# EAGLE design Teensy_CARD_V2 (EAGLE 9.7.0)
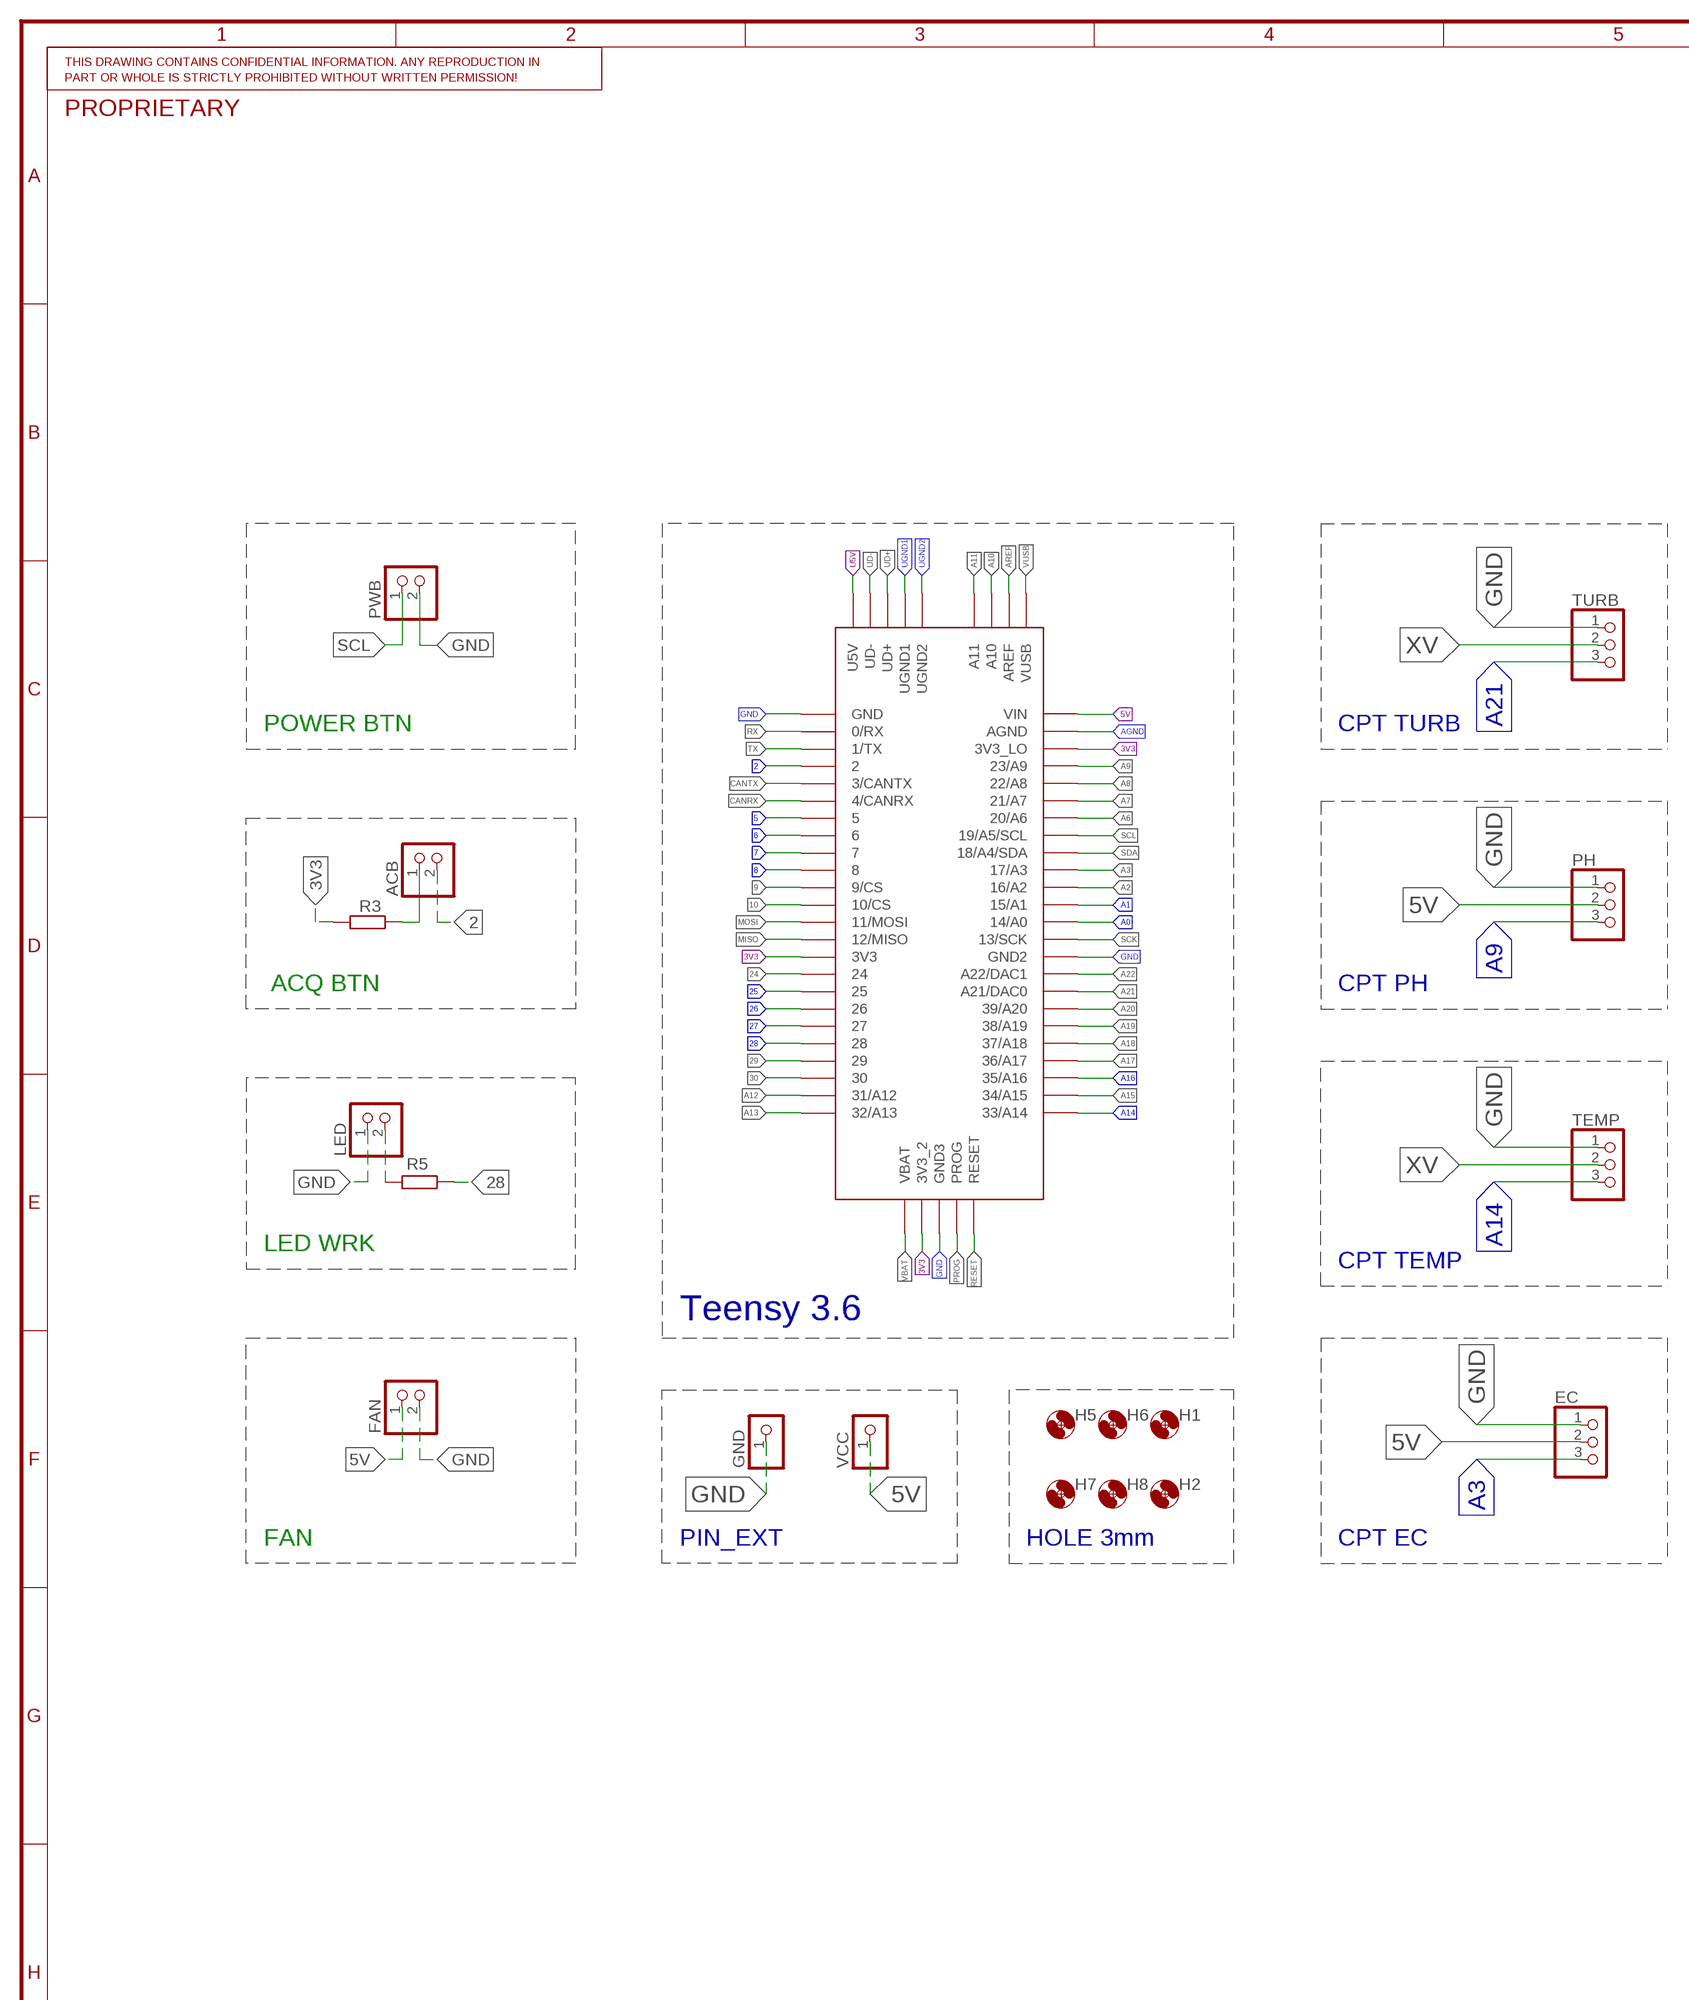
[diagram p0: schematic, sheet 1, part 1 of 2]
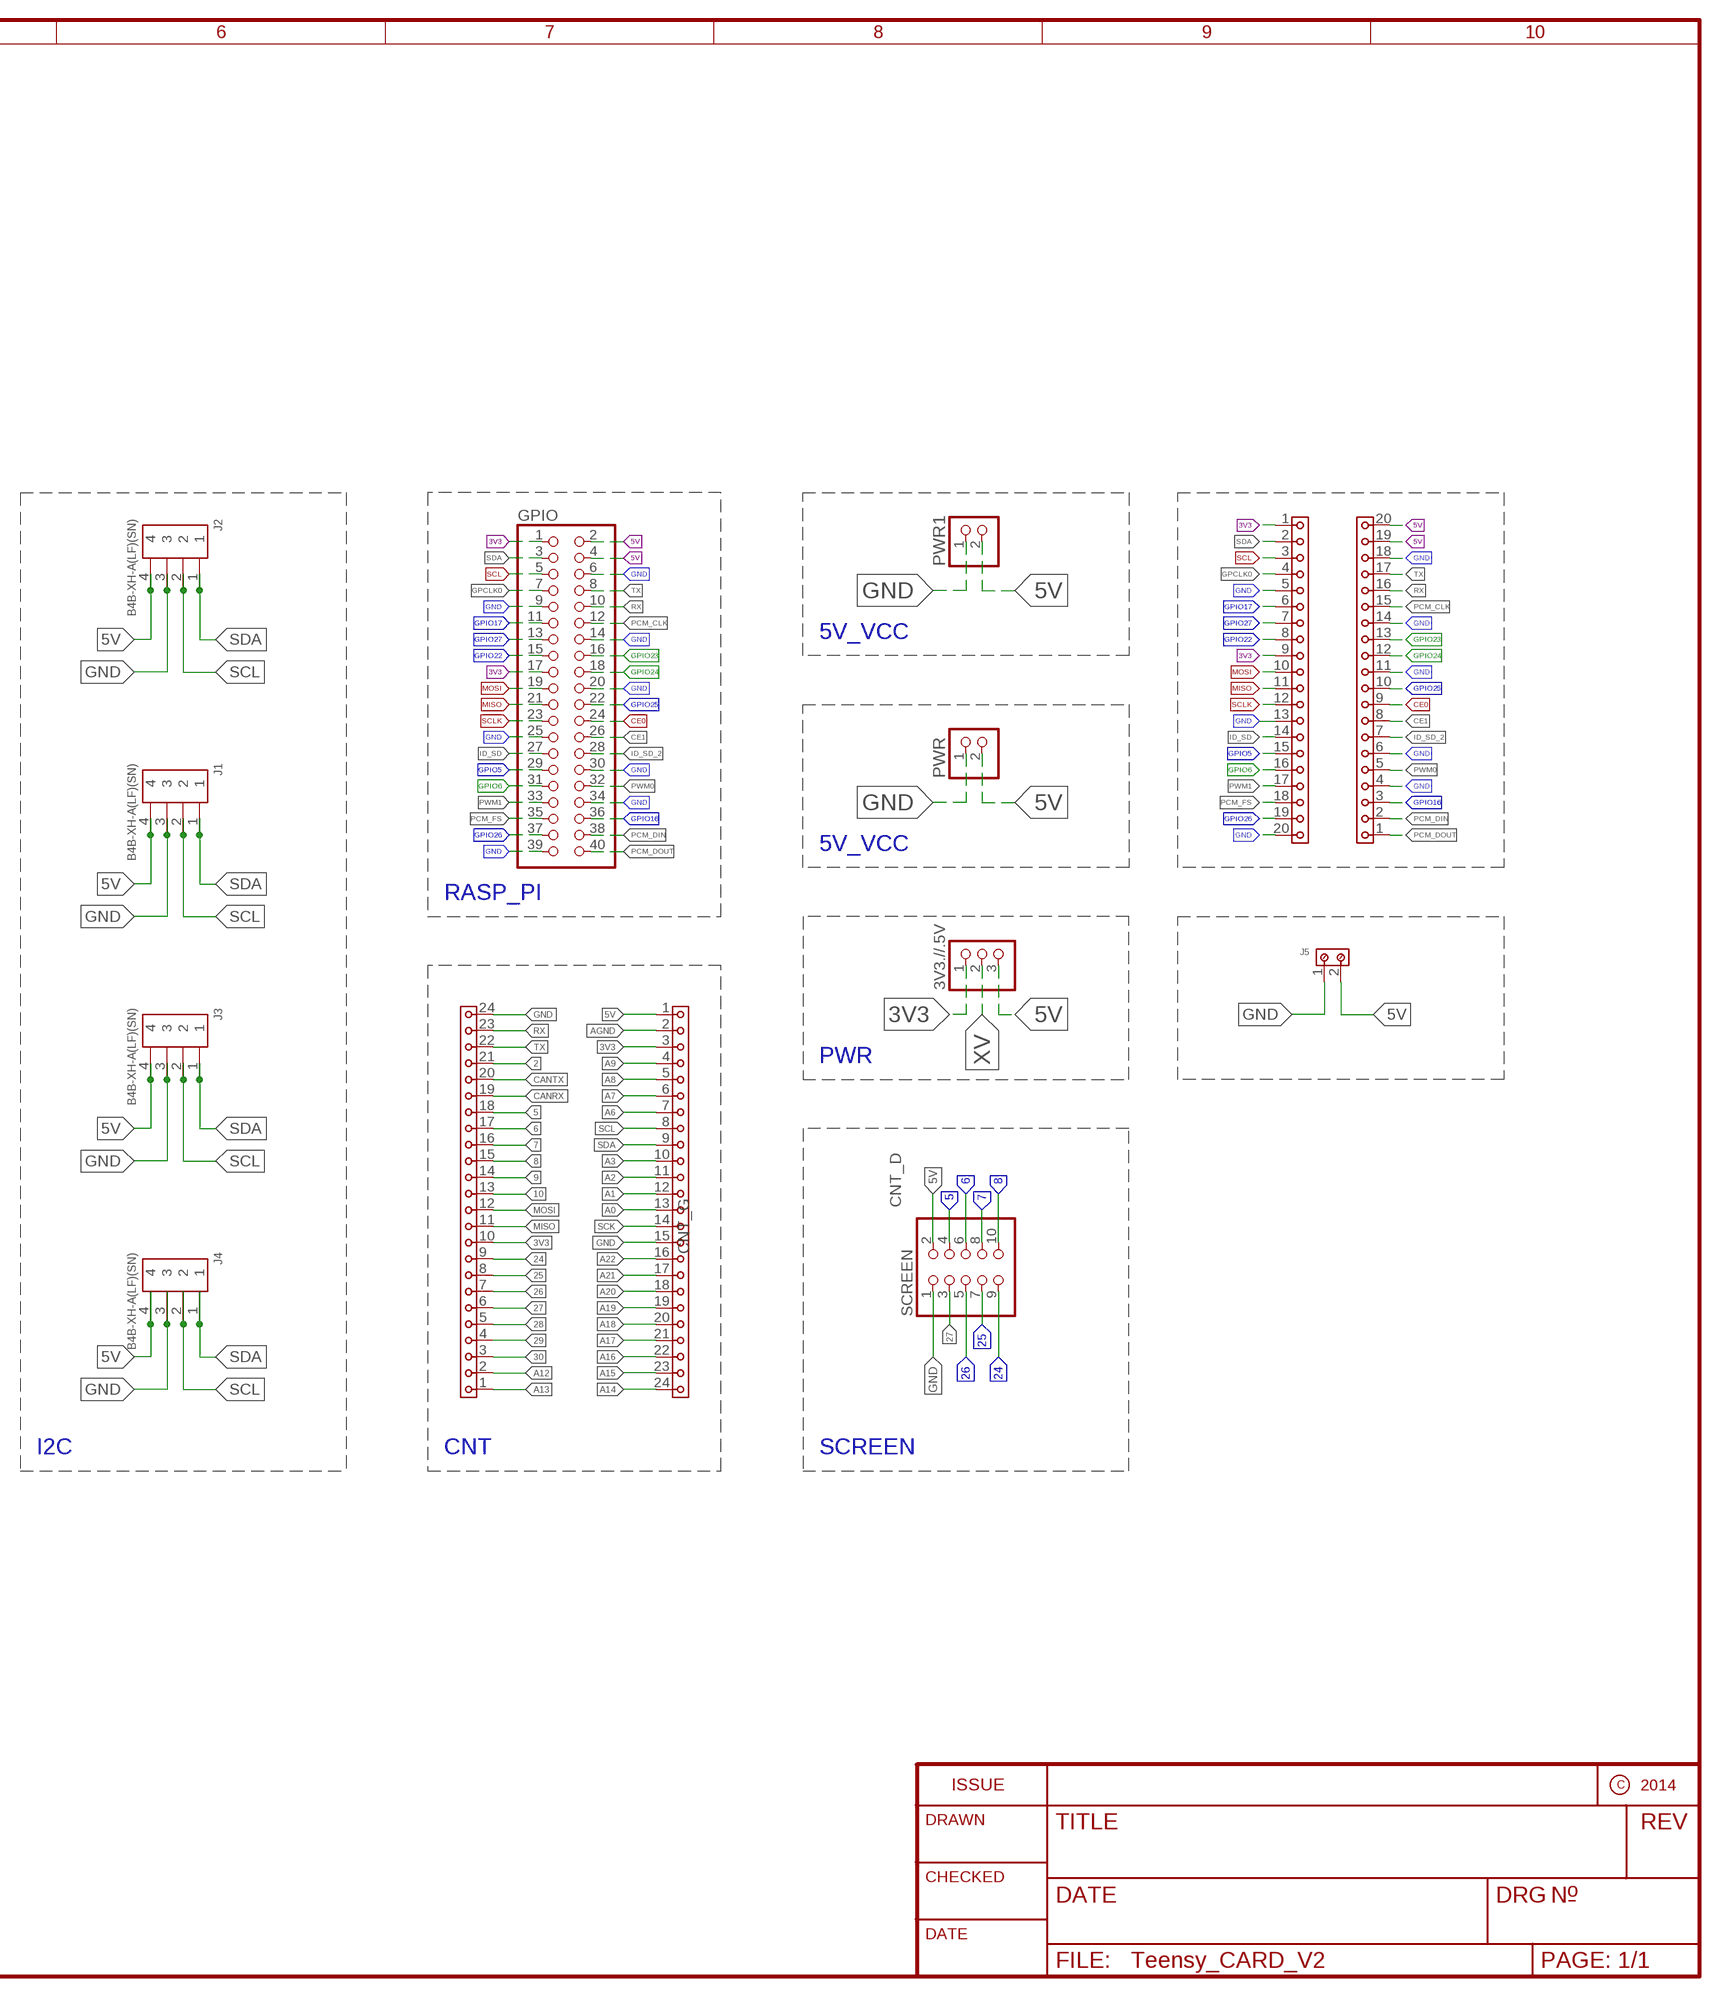
[diagram p1: schematic, sheet 1, part 2 of 2]

## Parts
3V3.//.5V  PINHD-1X3  [1X03]
ACB  PINHD-1X2  [1X02]
CNT_D  6130XX11821_61302411821  [61302411821]
CNT_G  6130XX11821_61302411821  [61302411821]
EC  PINHD-1X3  [1X03]
FAN  PINHD-1X2  [1X02]
GND  PINHD-1X1  [1X01]
GPIO  PINHD-2X20  [2X20]
H1  MOUNT-HOLE3.0  [3,0]
H2  MOUNT-HOLE3.0  [3,0]
H5  MOUNT-HOLE3.0  [3,0]
H6  MOUNT-HOLE3.0  [3,0]
H7  MOUNT-HOLE3.0  [3,0]
H8  MOUNT-HOLE3.0  [3,0]
J1  B4B-XH-A(LF)(SN)  [B4B-XH-A(LF)(SN)]
J2  B4B-XH-A(LF)(SN)  [B4B-XH-A(LF)(SN)]
J3  B4B-XH-A(LF)(SN)  [B4B-XH-A(LF)(SN)]
J4  B4B-XH-A(LF)(SN)  [B4B-XH-A(LF)(SN)]
J5  691213510002  [691213510002]
JP1  6130XX11821_61302011821  [61302011821]
JP2  6130XX11821_61302011821  [61302011821]
LED  PINHD-1X2  [1X02]
PH  PINHD-1X3  [1X03]
PWB  PINHD-1X2  [1X02]
PWR  PINHD-1X2  [1X02]
PWR1  PINHD-1X2  [1X02]
R3  R-EU_0207/10  [0207/10]
R5  R-EU_0207/10  [0207/10]
SCREEN  PINHD-2X5  [2X05]
TEMP  PINHD-1X3  [1X03]
TURB  PINHD-1X3  [1X03]
U$1  TEENSY_3.5/3.6  [TEENSY_3.5/3.6]
VCC  PINHD-1X1  [1X01]

## Nets
2: ACB.2 CNT_G.21 U$1.2
3V3: 3V3.//.5V.1 CNT_D.3 CNT_G.10 GPIO.1 GPIO.17 JP1.1 JP1.9 R3.1 U$1.3V3 U$1.3V3_2 U$1.3V3_LO
5: CNT_G.18 SCREEN.4 U$1.5
5V: 3V3.//.5V.3 CNT_D.1 EC.2 FAN.1 GPIO.2 GPIO.4 J1.4 J2.4 J3.4 J4.4 J5.2 JP2.19 JP2.20 PH.2 PWR1.2 PWR.2 SCREEN.2 U$1.VIN VCC.1
6: CNT_G.17 SCREEN.6 U$1.6
7: CNT_G.16 SCREEN.8 U$1.7
8: CNT_G.15 SCREEN.10 U$1.8
9: CNT_G.14 U$1.9/CS
10: CNT_G.13 U$1.10/CS
24: CNT_G.9 SCREEN.9 U$1.24
25: CNT_G.8 SCREEN.7 U$1.25
26: CNT_G.7 SCREEN.5 U$1.26
27: CNT_G.6 SCREEN.3 U$1.27
28: CNT_G.5 R5.1 U$1.28
29: CNT_G.4 U$1.29
30: CNT_G.3 U$1.30
A0: CNT_D.13 U$1.14/A0
A1: CNT_D.12 U$1.15/A1
A2: CNT_D.11 U$1.16/A2
A3: CNT_D.10 EC.3 U$1.17/A3
A6: CNT_D.7 U$1.20/A6
A7: CNT_D.6 U$1.21/A7
A8: CNT_D.5 U$1.22/A8
A9: CNT_D.4 PH.3 U$1.23/A9
A10: U$1.A10
A11: U$1.A11
A12: CNT_G.2 U$1.31/A12
A13: CNT_G.1 U$1.32/A13
A14: CNT_D.24 TEMP.3 U$1.33/A14
A15: CNT_D.23 U$1.34/A15
A16 [GND]: CNT_D.22 U$1.35/A16
A17: CNT_D.21 U$1.36/A17
A18: CNT_D.20 U$1.37/A18
A19: CNT_D.19 U$1.38/A19
A20: CNT_D.18 U$1.39/A20
A21: CNT_D.17 TURB.3 U$1.21/DAC0(A21/DAC0)
A22: CNT_D.16 U$1.A22/DAC1
AGND: CNT_D.2 U$1.AGND
AREF: U$1.AREF
CANRX: CNT_G.19 U$1.4/CANRX
CANTX: CNT_G.20 U$1.3/CANTX
CE0: GPIO.24 JP2.9
CE1: GPIO.26 JP2.8
GND: CNT_D.15 CNT_G.24 EC.1 FAN.2 GND.1 GPIO.6 GPIO.9 GPIO.14 GPIO.20 GPIO.25 GPIO.30 GPIO.34 GPIO.39 J1.3 J2.3 J3.3 J4.3 J5.1 JP1.5 JP1.13 JP1.20 JP2.4 JP2.6 JP2.11 JP2.14 JP2.18 LED.1 PH.1 PWB.2 PWR1.1 PWR.1 SCREEN.1 TEMP.1 TURB.1 U$1.GND U$1.GND2 U$1.GND3
GPCLK0: GPIO.7 JP1.4
GPIO5: GPIO.29 JP1.15
GPIO6: GPIO.31 JP1.16
GPIO16: GPIO.36 JP2.3
GPIO17: GPIO.11 JP1.6
GPIO22: GPIO.15 JP1.8
GPIO23: GPIO.16 JP2.13
GPIO24: GPIO.18 JP2.12
GPIO25: GPIO.22 JP2.10
GPIO26: GPIO.37 JP1.19
GPIO27: GPIO.13 JP1.7
ID_SD: GPIO.27 JP1.14
ID_SD_2: GPIO.28 JP2.7
MISO: CNT_G.11 GPIO.21 JP1.11 U$1.12/MISO
MOSI: CNT_G.12 GPIO.19 JP1.10 U$1.11/MOSI
N$1: ACB.1 R3.2
N$3: LED.2 R5.2
PCM_CLK: GPIO.12 JP2.15
PCM_DIN: GPIO.38 JP2.2
PCM_DOUT: GPIO.40 JP2.1
PCM_FS: GPIO.35 JP1.18
PROG: U$1.PROG
PWM0: GPIO.32 JP2.5
PWM1: GPIO.33 JP1.17
RESET: U$1.RESET
RX: CNT_G.23 GPIO.10 JP2.16 U$1.0/RX
SCK: CNT_D.14 U$1.13/SCK
SCL: CNT_D.8 GPIO.5 J1.2 J2.2 J3.2 J4.2 JP1.3 PWB.1 U$1.19/A5/SCL
SCLK: GPIO.23 JP1.12
SDA: CNT_D.9 GPIO.3 J1.1 J2.1 J3.1 J4.1 JP1.2 U$1.18/A4/SDA
TX: CNT_G.22 GPIO.8 JP2.17 U$1.1/TX
U5V: U$1.U5V
UD+: U$1.UD+
UD-: U$1.UD-
UGND1: U$1.UGND1
UGND2: U$1.UGND2
VBAT: U$1.VBAT
VUSB: U$1.VUSB
XV: 3V3.//.5V.2 TEMP.2 TURB.2

## Notes on the sheet
- 5V_VCC
- POWER BTN | CPT TURB
- 5V_VCC
- RASP_PI
- ACQ BTN | CPT PH
- PWR
- LED WRK
- CPT TEMP
- Teensy 3.6
- FAN | PIN_EXT | HOLE 3mm | CPT EC | I2C | CNT | SCREEN

## Library data of the parts
3V3.//.5V EC PH TEMP TURB = Connector:PINHD-1X3: PIN HEADER; CATEGORY: CONNECTOR; SUB-CATEGORY: PIN-HEADER
ACB FAN LED PWB = pinhead:PINHD-1X2: PIN HEADER
CNT_D CNT_G = Wurth_Connectors_WR-PHD:6130XX11821_61302411821: WR-PHD 2.54 mm Socket Header ARTICLE PROPERTIES: Pins:1;​ 2;​ 3;​ 4;​ 5;​ 6;​ 7;​ 8;​ 9;​ 10;​ 12;​ 13;​ 14;​ 15;​ 16;​ 18;​ 20;​ 22;​ 24;​ 25;​ 32;​ 36;​ 40 KIND PROPERTIES: Pitch：2.54 mm Quality Class:3 as per CECC 75 301-802 Rows：Single Gender：Socket Header;​ Female Type：Straight MATERIAL PROPERTIES: Insulator Material :PBT Insulator Flammability Rating:UL94 V-0 Contact Material:Copper Alloy Contact Plating:Gold Contact Type:Stamped GENERAL INFORMATION Operating Temperature:-40 up to +125 °C Compliance:Lead free / RoHS ELECTRICAL PROPERTIES: Rated Current:3 A IR 1:3 A Withstanding Voltage:500 V (AC) Contact Resistance:20 mΩ RISO:1000 MΩ CERTIFICATION UL Approval:E323964 PACKAGING PROPERTIES Packaging:Tray <https://katalog.we-online.com/media/images/v2/o33218v209%20Family_WR-PHD_613xxx11821.jpg> Details see: https://katalog.we-online.com/en/em/PHD_2_54_SOCKET_HEADER_6130XX11821 Updated by Yingchun,Shan 2019-10-21 2019 (C) Würth Elektronik; DATASHEET-URL: https://katalog.we-online.com/em/datasheet/61302411821.pdf; GENDER: Socket Header; IR: 3A; MATES: WR-PHD 2.54mm SMT Pin Header/THT Angled Pin Header/THT Pin Header; PACKAGING: Tray; PART-NUMBER: 61302411821; PINS: 24; ROWS: Single; TYPE: Straight
GND VCC = adafruit:PINHD-1X1: Pin header 1x1 for 0.1" spacing With round pins
GPIO = Connector:PINHD-2X20: PIN HEADER; CATEGORY: CONNECTOR; SUB-CATEGORY: PIN-HEADER
H1 H2 H5-H8 = holes:MOUNT-HOLE: MOUNTING HOLE with drill center marker
J1-J4 = Headers:B4B-XH-A(LF)(SN): CONN HEADER VERT 4POS 2.5MM Manufacturer's datasheet <http://www.jst-mfg.com/product/pdf/eng/eXH.pdf>; CREATED_BY: PCBLayout.com; DIGIKEY_PARTNO: 455-2249-ND; MANUFACTURER: JST Sales America Inc.; MPN: B4B-XH-A(LF)(SN)
J5 = Wurth_Connectors_WR-TBL Rising Cage Clamp:691213510002: WR-TBL Serie 2135 - 5.08 mm Horizontal Entry Modular w. Rising Cage Clamp KIND PROPERTIES Pitch 5.08 mm MATERIAL PROPERTIES Insulator Material PA66 Insulator Flammability Rating UL94 V-0 Contact Material Copper Alloy Contact Plating Tin over Nickel Contact Type Stamped Terminal Screw Material Steel Terminal Screw Plating Zinc Wire Guard Material Copper Alloy GENERAL INFORMATION Operating Temperature -30 up to +120 °C Compliance ROHS & Reach ELECTRICAL PROPERTIES IR UL 14 A IR VDE 14 A Working Voltage [UL] 300 V (AC) Working Voltage [VDE] 250 V (AC) Withstanding Voltage [UL] 1600 V (AC) Withstanding Voltage [VDE] 2000 V (AC) Contact Resistance 20 mΩ MECHANICAL PROPERTIES Wire Strip Length 6 Screw M3 CERTIFICATION UL Approval E150931 VDE Approval 40021366 PACKAGING PROPERTIES Packaging Box <https://www.we-online.com/catalog/media/o32805v209%20Family_WR-TBL2_Series2135.jpg> Details see: https://www.we-online.com/catalog/en/TBL_5_08_2135_HORIZONTAL_ENTRY_MODULAR_69121351000x/ Updated by Ella Wu 2019-11-26 2019(C) Wurth Elektronik; IR-UL: 14A; IR-VDE: 14A; PART-NUMBER: 691213510002; PINS: 2; PITCH: 5.08mm; TYPE: Horizontal; WIRE: 14 to 30 (AWG) 2.08 to 0.0509 (mm²); WORKING-VOLTAGE-UL: 300V (AC); WORKING-VOLTAGE-VDE: 250V (AC)
JP1 JP2 = Wurth_Connectors_WR-PHD:6130XX11821_61302011821: WR-PHD 2.54 mm Socket Header ARTICLE PROPERTIES: Pins:1;​ 2;​ 3;​ 4;​ 5;​ 6;​ 7;​ 8;​ 9;​ 10;​ 12;​ 13;​ 14;​ 15;​ 16;​ 18;​ 20;​ 22;​ 24;​ 25;​ 32;​ 36;​ 40 KIND PROPERTIES: Pitch：2.54 mm Quality Class:3 as per CECC 75 301-802 Rows：Single Gender：Socket Header;​ Female Type：Straight MATERIAL PROPERTIES: Insulator Material :PBT Insulator Flammability Rating:UL94 V-0 Contact Material:Copper Alloy Contact Plating:Gold Contact Type:Stamped GENERAL INFORMATION Operating Temperature:-40 up to +125 °C Compliance:Lead free / RoHS ELECTRICAL PROPERTIES: Rated Current:3 A IR 1:3 A Withstanding Voltage:500 V (AC) Contact Resistance:20 mΩ RISO:1000 MΩ CERTIFICATION UL Approval:E323964 PACKAGING PROPERTIES Packaging:Tray <https://katalog.we-online.com/media/images/v2/o33218v209%20Family_WR-PHD_613xxx11821.jpg> Details see: https://katalog.we-online.com/en/em/PHD_2_54_SOCKET_HEADER_6130XX11821 Updated by Yingchun,Shan 2019-10-21 2019 (C) Würth Elektronik; DATASHEET-URL: https://katalog.we-online.com/em/datasheet/61302011821.pdf; GENDER: Socket Header; IR: 3A; MATES: WR-PHD 2.54mm SMT Pin Header/THT Angled Pin Header/THT Pin Header; PACKAGING: Tray; PART-NUMBER: 61302011821; PINS: 20; ROWS: Single; TYPE: Straight
PWR PWR1 = Connector:PINHD-1X2: PIN HEADER; CATEGORY: CONNECTOR; SUB-CATEGORY: PIN-HEADER
R3 R5 = rcl:R-EU_: RESISTOR, European symbol; SPICEPREFIX: R
SCREEN = Connector:PINHD-2X5: PIN HEADER; CATEGORY: CONNECTOR; SUB-CATEGORY: PIN-HEADER
U$1 = Teensy356:TEENSY_3.5/3.6

## Board
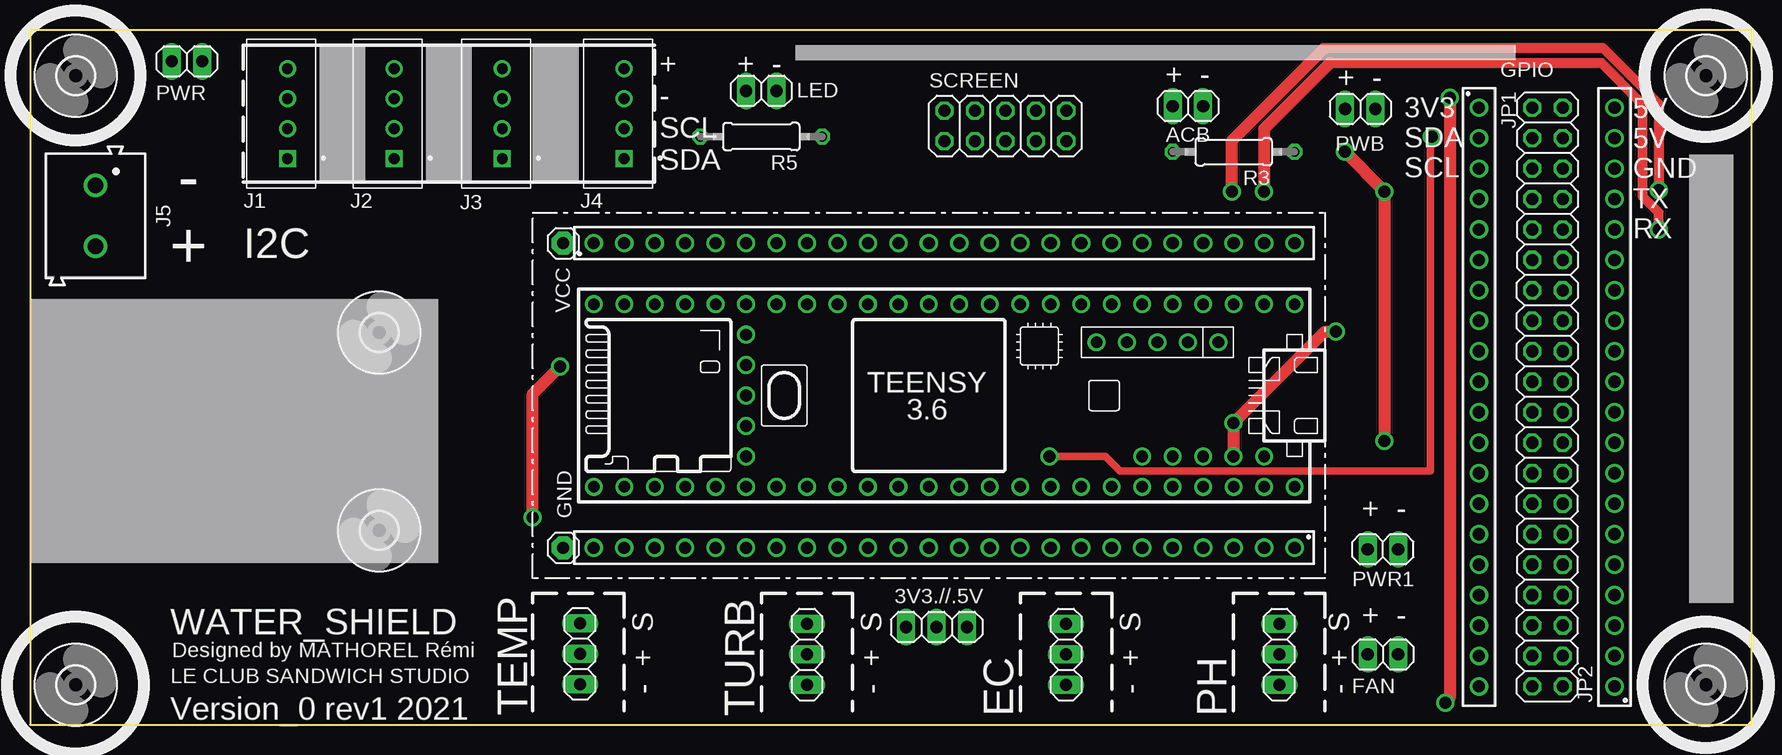
[diagram p2: board, top side]
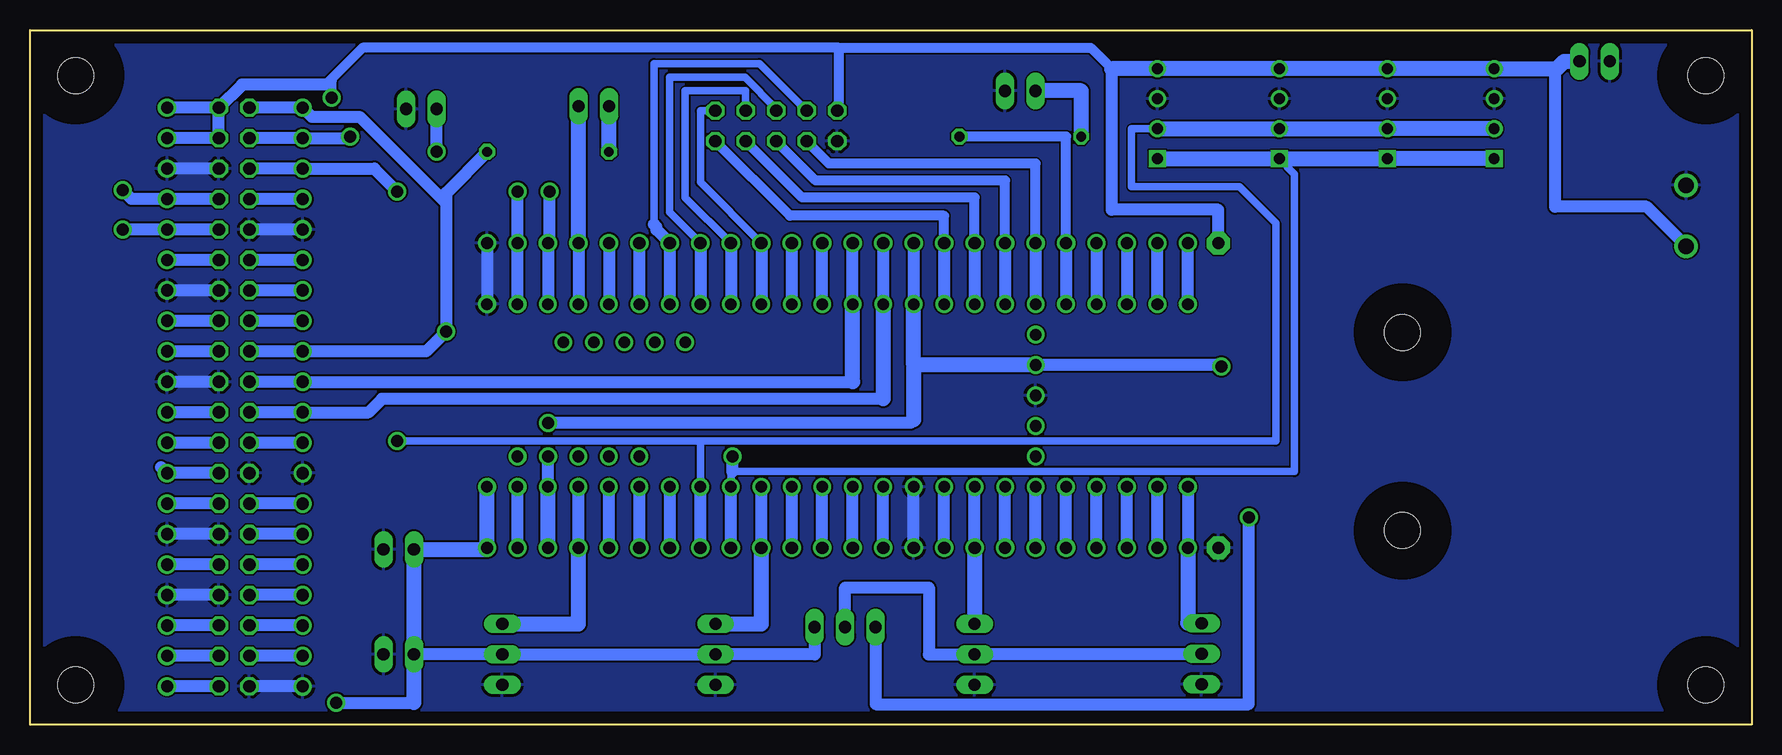
[diagram p3: board, bottom side, seen from below]

Size 143.51 x 57.93 mm. Coordinates in mm from the lower left corner, seen from the top.
Outline: 143.51,0 143.51,57.93 0,57.93 0,0 143.51,0
Copper layers (1*16): Top 0.035mm / dielectric 1.5mm / Bottom 0.035mm
Design rules "default": minimum track width 6mil, minimum drill 0.35mm, track to track 6mil, track to pad 6mil, pad to pad 6mil, via to via 6mil, smd to smd 6mil, copper to edge 40mil, drill to drill 6mil, minimum pad ring 10mil, minimum via ring 8mil, stop-mask expansion 4mil, vias tented up to drill 0mil, thermal gap 10mil

### Footprints (pad centres in the part's own frame; a part is rotated, then mirrored left to right if it is on the bottom)
1X03 = drill 1.016 long: 1 -2.54,0; 2 0,0; 3 2.54,0
1X02 = drill 1.016 long: 1 -1.27,0; 2 1.27,0
61302411821 = drill 1.02: 1 -29.21,0; 2 -26.67,0; 3 -24.13,0; 4 -21.59,0; 5 -19.05,0; 6 -16.51,0; 7 -13.97,0; 8 -11.43,0; 9 -8.89,0; 10 -6.35,0; 11 -3.81,0; 12 -1.27,0; 13 1.27,0; 14 3.81,0; 15 6.35,0; 16 8.89,0; 17 11.43,0; 18 13.97,0; 19 16.51,0; 20 19.05,0; 21 21.59,0; 22 24.13,0; 23 26.67,0; 24 29.21,0
1X01 = drill 1.016 pad 1.93 octagon: 1 0,0
2X20 = drill 1.016 octagon: 1 -24.13,-1.27; 2 -24.13,1.27; 3 -21.59,-1.27; 4 -21.59,1.27; 5 -19.05,-1.27; 6 -19.05,1.27; 7 -16.51,-1.27; 8 -16.51,1.27; 9 -13.97,-1.27; 10 -13.97,1.27; 11 -11.43,-1.27; 12 -11.43,1.27; 13 -8.89,-1.27; 14 -8.89,1.27; 15 -6.35,-1.27; 16 -6.35,1.27; 17 -3.81,-1.27; 18 -3.81,1.27; 19 -1.27,-1.27; 20 -1.27,1.27; 21 1.27,-1.27; 22 1.27,1.27; 23 3.81,-1.27; 24 3.81,1.27; 25 6.35,-1.27; 26 6.35,1.27; 27 8.89,-1.27; 28 8.89,1.27; 29 11.43,-1.27; 30 11.43,1.27; 31 13.97,-1.27; 32 13.97,1.27; 33 16.51,-1.27; 34 16.51,1.27; 35 19.05,-1.27; 36 19.05,1.27; 37 21.59,-1.27; 38 21.59,1.27; 39 24.13,-1.27; 40 24.13,1.27
3,0 = hole 3: 0,0
B4B-XH-A(LF)(SN) = drill 0.9 square: 1 -3.75,0 | drill 0.9: 2 -1.25,0; 3 1.25,0; 4 3.75,0
691213510002 = drill 1.3: 1 -2.54,0; 2 2.54,0
61302011821 = drill 1.02: 1 -24.13,0; 2 -21.59,0; 3 -19.05,0; 4 -16.51,0; 5 -13.97,0; 6 -11.43,0; 7 -8.89,0; 8 -6.35,0; 9 -3.81,0; 10 -1.27,0; 11 1.27,0; 12 3.81,0; 13 6.35,0; 14 8.89,0; 15 11.43,0; 16 13.97,0; 17 16.51,0; 18 19.05,0; 19 21.59,0; 20 24.13,0
0207/10 = drill 0.813 octagon: 1 -5.08,0; 2 5.08,0
2X05 = drill 1.016 octagon: 1 -5.08,-1.27; 2 -5.08,1.27; 3 -2.54,-1.27; 4 -2.54,1.27; 5 0,-1.27; 6 0,1.27; 7 2.54,-1.27; 8 2.54,1.27; 9 5.08,-1.27; 10 5.08,1.27
TEENSY_3.5/3.6 = drill 0.965: 0/RX -25.4,-7.62; 1/TX -22.86,-7.62; 2 -20.32,-7.62; 3/CANTX -17.78,-7.62; 3V3 7.62,-7.62; 3V3_2 17.78,-2.54; 3V3_LO -22.86,7.62; 4/CANRX -15.24,-7.62; 5 -12.7,-7.62; 6 -10.16,-7.62; 7 -7.62,-7.62; 8 -5.08,-7.62; 9/CS -2.54,-7.62; 10/CS 0,-7.62; 11/MOSI 2.54,-7.62; 12/MISO 5.08,-7.62; 13/SCK 5.08,7.62; 14/A0 2.54,7.62; 15/A1 0,7.62; 16/A2 -2.54,7.62; 17/A3 -5.08,7.62; 18/A4/SDA -7.62,7.62; 19/A5/SCL -10.16,7.62; 20/A6 -12.7,7.62; 21/A7 -15.24,7.62; 21/DAC0 12.7,7.62; 22/A8 -17.78,7.62; 23/A9 -20.32,7.62; 24 10.16,-7.62; 25 12.7,-7.62; 26 15.24,-7.62; 27 17.78,-7.62; 28 20.32,-7.62; 29 22.86,-7.62; 30 25.4,-7.62; 31/A12 27.94,-7.62; 32/A13 30.48,-7.62; 33/A14 30.48,7.62; 34/A15 27.94,7.62; 35/A16 25.4,7.62; 36/A17 22.86,7.62; 37/A18 20.32,7.62; 38/A19 17.78,7.62; 39/A20 15.24,7.62; A10 -17.78,5.08; A11 -15.24,5.08; A22/DAC1 10.16,7.62; AGND -25.4,7.62; AREF -20.32,5.08; GND -27.94,-7.62; GND2 7.62,7.62; GND3 17.78,0; PROG 17.78,2.54; RESET 17.78,5.08; U5V -21.59,-4.445; UD+ -16.51,-4.445; UD- -19.05,-4.445; UGND1 -13.97,-4.445; UGND2 -11.43,-4.445; VBAT 17.78,-5.08; VIN -27.94,7.62; VUSB -25.4,5.08

### Placement (x,y rotation side)
3V3.//.5V  75.56,8.15 0 top
ACB  96.52,51.58 0 top
CNT_D  76.2,14.75 180 top
CNT_G  76.2,40.16 0 top
EC  86.36,5.86 90 top
FAN  112.78,5.86 0 top
GND  44.45,14.75 90 top
GPIO  126.49,27.32 270 top
H1  29.1,32.71 0 top
H2  29.1,16.2 0 top
H5  3.81,3.32 0 top
H6  3.81,54.12 0 top
H7  139.7,3.32 0 top
H8  139.7,54.12 0 top
J1  21.46,50.95 90 top
J2  30.35,50.95 90 top
J3  39.37,50.95 90 top
J4  49.53,50.95 90 top
J5  5.46,42.44 270 top
JP1  120.78,27.32 270 top
JP2  132.08,27.32 90 top
LED  60.96,52.85 180 top
PH  104.14,5.86 90 top
PWB  110.89,51.34 0 top
PWR  13.08,55.31 0 top
PWR1  112.78,14.62 180 top
R3  100.33,47.77 180 top
R5  60.96,49.04 180 top
SCREEN  81.31,49.93 0 top
TEMP  45.85,5.92 90 top
TURB  64.77,5.86 90 top
U$1  77.47,27.45 180 top
VCC  44.45,40.15 90 top

### Tracks (layer width: path | path; a pad name or v marks a point on that pad's centre or on a via)
2
  Bottom 1.016: CNT_G.21 U$1.2
  Bottom 1.27: CNT_G.21 ACB.2
3V3  (via drill 1)
  Top 1.016: v100.33,22.37 v100.33,25.16 107.95,32.78 v108.84,32.78 | v41.91,17.29 41.91,27.58 v44.2,29.86
  Bottom 1.016: CNT_G.10 U$1.3V3 | 3V3.//.5V.1 73.03,1.7 41.91,1.7 v41.91,17.29 | U$1.3V3_LO v100.33,22.37 | 69.85,25.42 70.1,25.16 v100.33,25.16 | v44.2,29.86 44.32,29.99 U$1.3V3_2 | GPIO.1 JP1.1 120.02,50.69 116.04,50.69 108.84,43.49 | GPIO.17 JP1.9 110.49,31.13 v108.84,32.78 108.84,43.49 | R3.1 108.84,44.34 108.84,43.49
  Bottom 1.27: 69.85,29.99 69.85,25.42 | 69.85,29.99 U$1.3V3 | U$1.3V3_2 69.85,29.99 | CNT_D.3 U$1.3V3_LO
5
  Bottom 0.61: 91.5,41.73 91.5,55.14 82.7,55.14 SCREEN.4
  Bottom 1.016: U$1.5 CNT_G.18 91.29,41.28 91.29,41.51 91.5,41.73
5V  (via drill 1)
  Top 1.016: v118.35,52.28 118.35,2.21 v117.98,1.84
  Bottom 0.813: 76.07,56.43 55.08,56.43 53.34,54.7 | SCREEN.2 76.07,51.35 76.07,56.43 | 76.07,56.43 115.8,56.43 118.43,53.8 | 118.43,53.8 118.85,53.38 | v118.35,52.28 118.35,53.73 118.43,53.8
  Bottom 1.016: 3V3.//.5V.3 78.11,5.86 EC.2 PH.2 FAN.1 | VCC.1 44.45,42.94 53.34,42.94 53.34,54.7 | SCREEN.2 76.2,51.22 | v117.98,1.84 111.51,1.84 | GPIO.2 GPIO.4 JP2.19 | 118.85,53.38 125.83,53.38 GPIO.2 | GPIO.2 JP2.20 | 16.38,54.7 16.38,43.18 8.75,43.18 J5.2
  Bottom 1.27: U$1.VIN CNT_D.1 105.54,14.62 PWR1.2 FAN.1 111.51,1.84 | 53.34,54.7 J4.4 J3.4 J2.4 J1.4 16.38,54.7 16.24,54.7 15.62,55.31 PWR.2
6
  Bottom 0.61: CNT_G.17 90.2,42.73 90.2,53.99 83.91,53.99 81.31,51.39 SCREEN.6
  Bottom 1.016: CNT_G.17 U$1.6
7
  Bottom 0.61: SCREEN.8 83.84,52.85 88.9,52.85 88.9,43.97 CNT_G.16
  Bottom 1.016: CNT_G.16 U$1.7
8
  Bottom 0.61: SCREEN.10 87.63,51.2 87.63,45.23 CNT_G.15
  Bottom 1.016: CNT_G.15 U$1.8
9
  Bottom 1.016: U$1.9/CS CNT_G.14
10
  Bottom 1.016: U$1.10/CS CNT_G.13
24
  Bottom 0.813: SCREEN.9 80.16,42.44 67.31,42.44 CNT_G.9
  Bottom 1.016: CNT_G.9 U$1.24
25
  Bottom 0.813: CNT_G.8 64.77,43.96 79.15,43.96 SCREEN.7
  Bottom 1.016: CNT_G.8 U$1.25
26
  Bottom 0.813: SCREEN.5 78.03,45.38 62.23,45.38 CNT_G.7
  Bottom 1.016: CNT_G.7 U$1.26
27
  Bottom 0.813: CNT_G.6 59.69,46.8 76.91,46.8 SCREEN.3
  Bottom 1.016: CNT_G.6 U$1.27
28
  Bottom 0.813: R5.1 57.15,49.04 CNT_G.5
  Bottom 1.016: CNT_G.5 U$1.28
29
  Bottom 1.016: CNT_G.4 U$1.29
30
  Bottom 1.016: CNT_G.3 U$1.30
A0
  Bottom 1.016: CNT_D.13 U$1.14/A0
A1
  Bottom 1.016: CNT_D.12 U$1.15/A1
A2
  Bottom 1.016: CNT_D.11 U$1.16/A2
A3
  Bottom 1.016: CNT_D.10 U$1.17/A3
  Bottom 1.27: EC.3 82.55,8.4 CNT_D.10
A6
  Bottom 1.016: CNT_D.7 U$1.20/A6
A7
  Bottom 1.016: CNT_D.6 U$1.21/A7
A8
  Bottom 1.016: CNT_D.5 U$1.22/A8
A9
  Bottom 1.016: CNT_D.4 U$1.23/A9
  Bottom 1.27: PH.3 97.79,8.4 CNT_D.4
A12
  Bottom 1.016: U$1.31/A12 CNT_G.2
A13
  Bottom 1.016: U$1.32/A13 CNT_G.1
A14
  Bottom 1.016: U$1.33/A14 CNT_D.24
  Bottom 1.27: TEMP.3 46.99,8.46 CNT_D.24
A15
  Bottom 1.016: CNT_D.23 U$1.34/A15
A16
  Bottom 1.016: CNT_D.22 U$1.35/A16
A17
  Bottom 1.016: CNT_D.21 U$1.36/A17
A18
  Bottom 1.016: CNT_D.20 U$1.37/A18
A19
  Bottom 1.016: CNT_D.19 U$1.38/A19
A20
  Bottom 1.016: CNT_D.18 U$1.39/A20
A21
  Bottom 1.016: CNT_D.17 U$1.21/DAC0
  Bottom 1.27: CNT_D.17 64.8,14.73 64.8,8.43 TURB.3
A22
  Bottom 1.016: CNT_D.16 U$1.A22/DAC1
AGND
  Bottom 1.016: CNT_D.2 U$1.AGND
CANRX
  Bottom 1.016: U$1.4/CANRX CNT_G.19
CANTX
  Bottom 1.016: CNT_G.20 U$1.3/CANTX
CE0
  Bottom 1.016: GPIO.24 JP2.9
CE1
  Bottom 1.016: GPIO.26 JP2.8 132.59,21.48
GND
  Bottom 1.016: CNT_D.15 U$1.GND2 | CNT_G.24 U$1.GND | JP1.5 GPIO.9 | JP1.20 GPIO.39 | GPIO.6 JP2.18 | GPIO.20 JP2.11 | GPIO.30 JP2.6 | GPIO.34 JP2.4 | GPIO.14 JP2.14
  pour Bottom: -3.68,-6.71 147.19,-6.71 147.19,62.88 -3.68,62.88
GPCLK0
  Bottom 1.016: JP1.4 GPIO.7
GPIO5
  Bottom 1.016: JP1.15 GPIO.29
GPIO6
  Bottom 1.016: JP1.16 GPIO.31
GPIO16
  Bottom 1.016: GPIO.36 JP2.3
GPIO17
  Bottom 1.016: JP1.6 GPIO.11
GPIO22
  Bottom 1.016: JP1.8 GPIO.15
GPIO23
  Bottom 1.016: GPIO.16 JP2.13
GPIO24
  Bottom 1.016: GPIO.18 JP2.12
GPIO25
  Bottom 1.016: GPIO.22 JP2.10
GPIO26
  Bottom 1.016: JP1.19 GPIO.37
GPIO27
  Bottom 1.016: JP1.7 GPIO.13
ID_SD
  Bottom 1.016: JP1.14 GPIO.27
ID_SD_2
  Bottom 1.016: GPIO.28 JP2.7
MISO
  Bottom 1.016: CNT_G.11 U$1.12/MISO | GPIO.21 JP1.11 115.29,26.05 114.17,27.17 72.39,27.17
  Bottom 1.27: U$1.12/MISO 72.39,27.17
MOSI
  Bottom 1.016: U$1.11/MOSI CNT_G.12 | GPIO.19 JP1.10 74.93,28.59
  Bottom 1.27: 74.93,28.59 U$1.11/MOSI
N$1
  Bottom 1.27: R3.2 ACB.1
N$3
  Bottom 1.27: R5.2 55.88,52.85 LED.2
PCM_CLK
  Bottom 1.016: GPIO.12 JP2.15
PCM_DIN
  Bottom 1.016: GPIO.38 JP2.2
PCM_DOUT
  Bottom 1.016: GPIO.40 JP2.1
PCM_FS
  Bottom 1.016: JP1.18 GPIO.35
PWM0
  Bottom 1.016: GPIO.32 JP2.5
PWM1
  Bottom 1.016: JP1.17 GPIO.33
RX  (via drill 1)
  Top 0.813: 108.36,55.16 131,55.16 134.16,52 134.16,51.97 134.45,51.68 134.45,44.02 135.76,42.71 v135.76,41.29
  Top 1.016: v102.87,44.47 102.87,49.67 108.36,55.16
  Bottom 1.016: U$1.0/RX CNT_G.23 v102.87,44.47 | GPIO.10 JP2.16 v135.76,41.29
SCK
  Bottom 1.016: CNT_D.14 U$1.13/SCK
SCL  (via drill 1)
  Top 1.016: v109.6,47.77 v112.9,44.47 v112.9,23.64
  Bottom 0.61: J4.2 51.69,49.7 51.69,44.85 42.7,44.85 39.67,41.82 39.67,23.64 87.63,23.64 | U$1.19/A5/SCL 87.63,23.64 | 87.63,23.64 v112.9,23.64
  Bottom 1.016: CNT_D.8 U$1.19/A5/SCL | GPIO.5 JP1.3 114.81,46.37 v112.9,44.47 | v109.6,47.77 109.62,47.79 PWB.1
  Bottom 1.27: J1.2 J2.2 J3.2 J4.2
SCLK
  Bottom 1.016: JP1.12 GPIO.23
SDA  (via drill 1)
  Top 0.61: v84.96,22.37 89.66,22.37 90.87,21.16 99.83,21.16 116.71,21.16 116.71,48.91 v116.84,49.04
  Bottom 0.61: J3.1 38.1,45.92 38.1,21.1 84.96,21.1 85.09,21.1 U$1.18/A4/SDA
  Bottom 1.016: CNT_D.9 U$1.18/A4/SDA | 84.96,21.1 v84.96,22.37 | GPIO.3 JP1.2 116.97,48.91 v116.84,49.04
  Bottom 1.27: J4.1 J3.1 J2.1 J1.1
TX  (via drill 1)
  Top 0.813: 107.82,56.33 107.93,56.43 131.1,56.43 135.13,52.4 135.13,52.37 135.76,51.73 v135.76,44.56 135.81,44.52
  Top 1.016: v100.2,44.47 100.2,48.71 107.82,56.33
  Bottom 1.016: U$1.1/TX CNT_G.22 100.2,40.29 v100.2,44.47 | GPIO.8 JP2.17 135.03,43.83 v135.76,44.56
XV
  Bottom 1.016: 3V3.//.5V.2 75.56,11.45 68.58,11.45 68.58,5.86 TURB.2 64.71,5.92 TEMP.2

### Text on the board
tPlace: I2C | WATER_SHIELD | Designed by MATHOREL Rémi | LE CLUB SANDWICH STUDIO | Version_0 rev1 2021
tNames: + - | + - | + - | + / - / SCL / SDA | 3V3 / SDA / SCL | 5V / 5V / GND / TX / RX | - / + | + - | + - | - + S | - + S | - + S | - + S